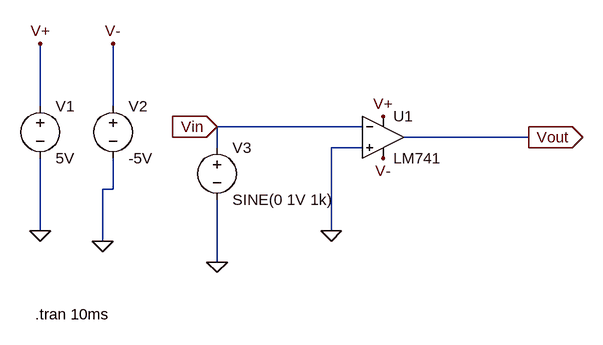
[diagram p0: schematic Draft1.asc]
Draft1.asc, the LTspice schematic file:
Version 4.1
SHEET 1 880 680
WIRE -288 112 -288 16
WIRE -176 112 -176 16
WIRE 208 144 -16 144
WIRE 464 160 272 160
WIRE -16 176 -16 144
WIRE 208 176 160 176
WIRE -176 240 -176 192
WIRE -176 240 -192 240
WIRE -288 304 -288 192
WIRE 160 304 160 176
WIRE -192 320 -192 240
WIRE -16 352 -16 256
FLAG 160 304 0
FLAG -288 304 0
FLAG -192 320 0
FLAG -288 16 V+
FLAG -176 16 V-
FLAG 240 128 V+
FLAG 240 192 V-
FLAG -16 352 0
FLAG -16 144 Vin
IOPIN -16 144 In
FLAG 464 160 Vout
IOPIN 464 160 Out
SYMBOL OpAmps\\LM741 240 96 R0
SYMATTR InstName U1
SYMBOL voltage -288 96 R0
SYMATTR InstName V1
SYMATTR Value 5V
SYMBOL voltage -176 96 R0
SYMATTR InstName V2
SYMATTR Value -5V
SYMBOL voltage -16 160 R0
SYMATTR InstName V3
SYMATTR Value SINE(0 1V 1k)
TEXT -296 432 Left 2 !.tran 10ms

The netlist it stands for:
* Draft1.asc
X§U1 0 Vin V+ V- Vout LM741  ; pins In+ In- V+ V- OUT
V1 V+ 0 5V
V2 V- 0 -5V
V3 Vin 0 SINE(0 1V 1k)
.tran 10ms
.lib LM741.lib
.backanno
.end